# Altium schematic sheet ser.SchDoc
size A4
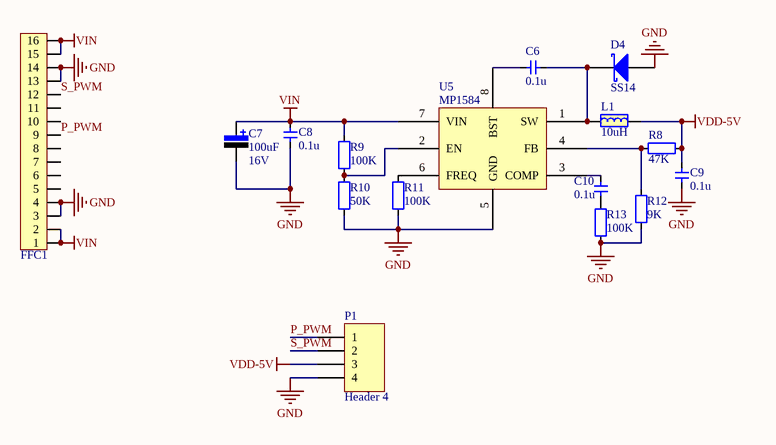
[diagram p0: ser.SchDoc]

## Parts
C6  value 0.1u  [0603-1]  (hidden comment: 电容-0603)
C7  value 100uF  Vol: 16V  [3528-CAP]  (hidden comment: 电容 3528)
C8  value 0.1u  [0603-1]  (hidden comment: 电容-0603)
C9  value 0.1u  [0603-1]  (hidden comment: 电容-0603)
C10  value 0.1u  [0603-1]  (hidden comment: 电容-0603)
D4  SS14  [DSO-C2/X2.3]
FFC1  FFC_0.5_16  [FFC_0.5_16]  (value not drawn)
L1  10uH  [L-SMD-7]
P1  Header 4  [HDR1X4]
R8  value 47K  [0603-1]  (hidden comment: 100K)
R9  100K  [0603-1]
R10  value 50K  [0603-1]  (hidden comment: 100K)
R11  100K  [0603-1]
R12  value 9K  [0603-1]  (hidden comment: 100K)
R13  100K  [0603-1]
U5  MP1584  [SO-8]

## Nets
GND: C7.2 C8.1 C9.2 D4.1(A) FFC1.3 FFC1.4 FFC1.13 FFC1.14 P1.4 R10.1 R11.1 R12.1 R13.1 U5.5(GND)
VDD-5V: C9.1 L1.2 P1.3 R8.1
VIN: C7.1 C8.2 FFC1.1 FFC1.2 FFC1.15 FFC1.16 R9.2 U5.7(VIN)
P_PWM: FFC1.9 P1.1
S_PWM: FFC1.12 P1.2
NetC6_1: C6.1 U5.8(BST)
NetC6_2: C6.2 D4.2(K) L1.1 U5.1(SW)
NetC10_1: C10.1 R13.2
NetC10_2: C10.2 U5.3(COMP)
NetR8_2: R8.2 R12.2 U5.4(FB)
NetR9_1: R9.1 R10.2 U5.2(EN)
NetR11_2: R11.2 U5.6(FREQ)

Not connected (* = marked no-connect by the designer): FFC1 5 6 7 8 10 11

## Library data of the parts
C6 C8-C10 = 电容-0603: Capacitor
C7 = 电容 3528: 极性电解电容; Published: 8-Jun-2000; LatestRevisionDate: 17-Jul-2002; LatestRevisionNote: Re-released for DXP Platform.; PackageReference: RB7.6-15; Publisher: Altium Limited
D4 = Diode
FFC1 = FFC_0.5_16: FFC
L1 = 电感-0805: 磁珠
P1 = Header 4: Header, 4-Pin; LatestRevisionDate: 17-Jul-2002; LatestRevisionNote: Re-released for DXP Platform.; Publisher: Altium Limited
R8-R13 = 电阻-0603: Resistor
  R9 R11 R13: Value: 100K
U5 = MP1584: 电源芯片